# Altium schematic sheet POWER.SchDoc
size A4; SheetNumber: 5; SheetTotal: 8
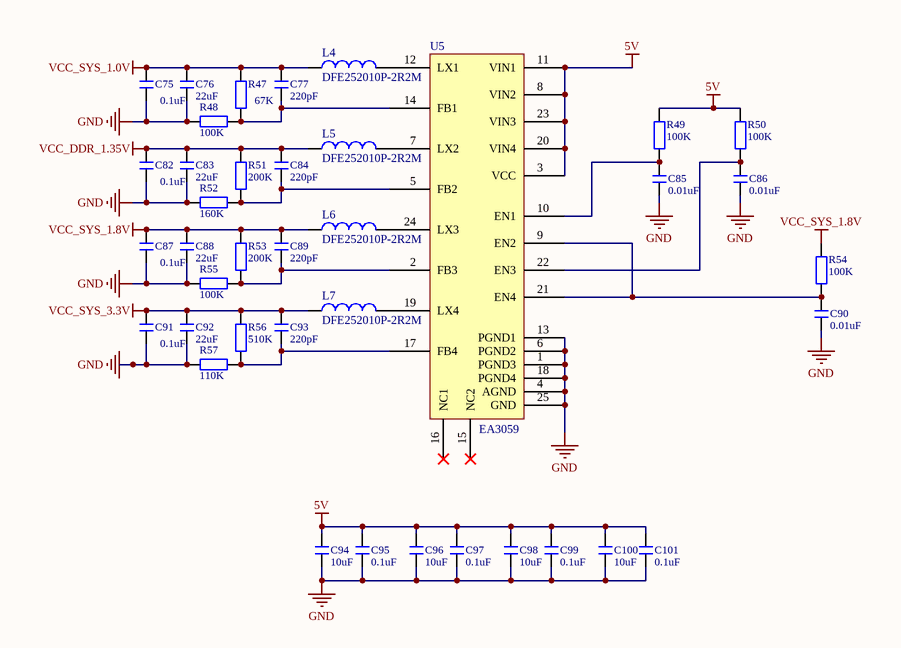
[diagram p0: POWER.SchDoc]

## Parts
C75  0.1uF  [C 0402]
C76  22uF  [C 0603]
C77  220pF  [C 0402]
C82  0.1uF  [C 0402]
C83  22uF  [C 0603]
C84  220pF  [C 0402]
C85  0.01uF  [C 0402]
C86  0.01uF  [C 0402]
C87  0.1uF  [C 0402]
C88  22uF  [C 0603]
C89  220pF  [C 0402]
C90  0.01uF  [C 0402]
C91  0.1uF  [C 0402]
C92  22uF  [C 0603]
C93  220pF  [C 0402]
C94  10uF  [C 0603]
C95  0.1uF  [C 0402]
C96  10uF  [C 0603]
C97  0.1uF  [C 0402]
C98  10uF  [C 0603]
C99  0.1uF  [C 0402]
C100  10uF  [C 0603]
C101  0.1uF  [C 0402]
L4  DFE252010P-2R2M  [L2520]
L5  DFE252010P-2R2M  [L2520]
L6  DFE252010P-2R2M  [L2520]
L7  DFE252010P-2R2M  [L2520]
R47  67K  [R 0402]
R48  100K  [R 0402]
R49  100K  [R 0402]
R50  100K  [R 0402]
R51  200K  [R 0402]
R52  160K  [R 0402]
R53  200K  [R 0402]
R54  100K  [R 0402]
R55  100K  [R 0402]
R56  510K  [R 0402]
R57  110K  [R 0402]
U5  EA3059  [VQFN-24_L4.0-W4.0-P0.50-TL-EP2.5]

## Nets
5V: C94.1 C95.1 C96.1 C97.1 C98.1 C99.1 C100.1 C101.1 R49.2 R50.2 U5.3(VCC) U5.8(VIN2) U5.11(VIN1) U5.20(VIN4) U5.23(VIN3)
GND: C75.1 C76.1 C82.1 C83.1 C85.1 C86.2 C87.1 C88.1 C90.2 C91.1 C92.1 C94.2 C95.2 C96.2 C97.2 C98.2 C99.2 C100.2 C101.2 R48.2 R52.2 R55.2 R57.2 U5.1(PGND3) U5.4(AGND) U5.6(PGND2) U5.13(PGND1) U5.18(PGND4) U5.25(GND)
VCC_DDR_1.35V: C82.2 C83.2 C84.2 L5.1 R51.2
VCC_SYS_1.0V: C75.2 C76.2 C77.2 L4.1 R47.2
VCC_SYS_1.8V: C87.2 C88.2 C89.2 L6.1 R53.2 R54.2
VCC_SYS_3.3V: C91.2 C92.2 C93.2 L7.1 R56.2
NetC77_1: C77.1 R47.1 R48.1 U5.14(FB1)
NetC84_1: C84.1 R51.1 R52.1 U5.5(FB2)
NetC85_2: C85.2 R49.1 U5.10(EN1)
NetC86_1: C86.1 R50.1 U5.22(EN3)
NetC89_1: C89.1 R53.1 R55.1 U5.2(FB3)
NetC90_1: C90.1 R54.1 U5.9(EN2) U5.21(EN4)
NetC93_1: C93.1 R56.1 R57.1 U5.17(FB4)
NetL4_2: L4.2 U5.12(LX1)
NetL5_2: L5.2 U5.7(LX2)
NetL6_2: L6.2 U5.24(LX3)
NetL7_2: L7.2 U5.19(LX4)

Not connected (* = marked no-connect by the designer): U5 15(NC2)* 16(NC1)*

## Library data of the parts
C75-C77 C82-C101 = C: 无极性贴片电容; 版权归属: 正点原子; BOM名称: 无极性贴片电容; 学习资源: www.openedv.com
L4-L7 = DFE252010P-2R2M: 电感
R47-R57 = R: 贴片电阻; 版权归属: 正点原子; BOM名称: 贴片电阻; 学习资源: www.openedv.com
U5 = EA3059: 四路电源管理